# Altium schematic sheet Under Legs.SchDoc: =DocumentName
size A4; Organization: Queen's Formula SAE; Address1: 130 Stuart St, Kingston; Address2: Ontario; Address3: Canada; Address4: K7L 2V9; DocumentNumber: 1; Revision: 0; SheetNumber: 1; SheetTotal: 1
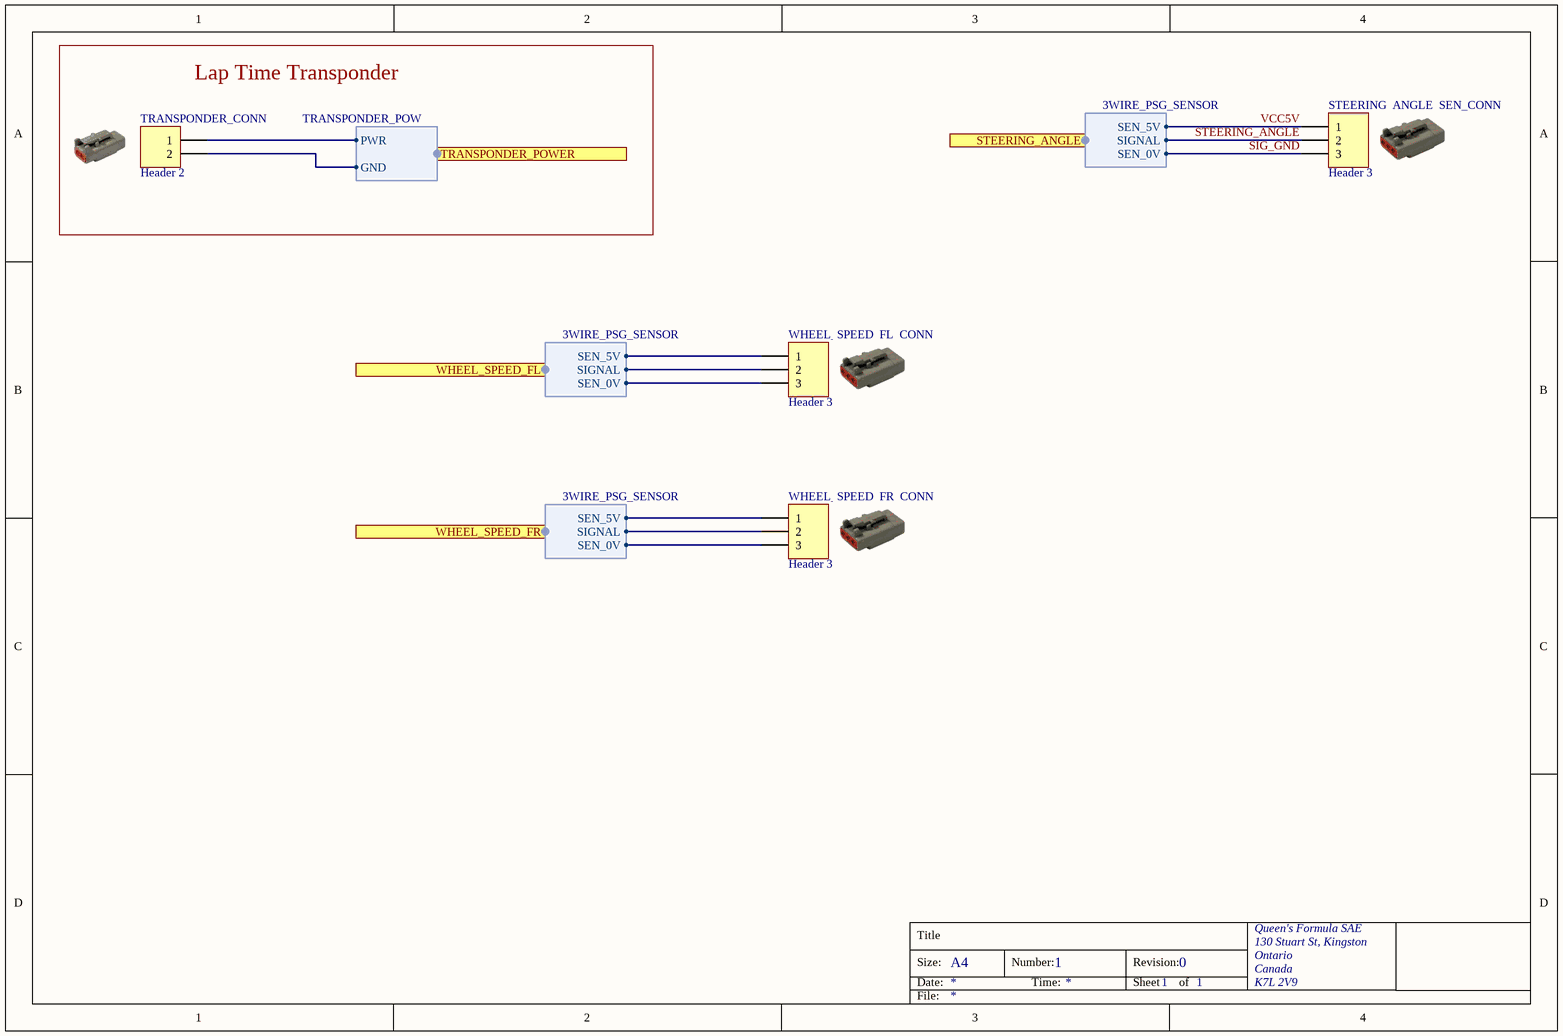
[diagram p0: Under Legs.SchDoc]

## Parts
STEERING_ANGLE_SEN_CONN  Header 3  [HDR1X3]
TRANSPONDER_CONN  Header 2  [HDR1X2]
WHEEL_SPEED_FL_CONN  Header 3  [HDR1X3]
WHEEL_SPEED_FR_CONN  Header 3  [HDR1X3]

## Blocks framed on the sheet
Lap Time Transponder: TRANSPONDER_CONN

## Ports
STEERING_ANGLE (harness 3WIRE_PSG_SENSOR), TRANSPONDER_POWER (harness TRANSPONDER_POW), WHEEL_SPEED_FL (harness 3WIRE_PSG_SENSOR), WHEEL_SPEED_FR (harness 3WIRE_PSG_SENSOR)

## Harnesses
3WIRE_PSG_SENSOR: SEN_5V, SEN_0V, SIGNAL
TRANSPONDER_POW: PWR, GND

## Nets
SIG_GND: STEERING_ANGLE_SEN_CONN.3 ; port STEERING_ANGLE.SEN_0V
STEERING_ANGLE: STEERING_ANGLE_SEN_CONN.2 ; port STEERING_ANGLE.SIGNAL
VCC5V: STEERING_ANGLE_SEN_CONN.1 ; port STEERING_ANGLE.SEN_5V
NetTRANSPONDER_CONN_1: TRANSPONDER_CONN.1 ; port TRANSPONDER_POWER.PWR
NetTRANSPONDER_CONN_2: TRANSPONDER_CONN.2 ; port TRANSPONDER_POWER.GND
NetWHEEL_SPEED_FL_CONN_1: WHEEL_SPEED_FL_CONN.1 ; port WHEEL_SPEED_FL.SEN_5V
NetWHEEL_SPEED_FL_CONN_2: WHEEL_SPEED_FL_CONN.2 ; port WHEEL_SPEED_FL.SIGNAL
NetWHEEL_SPEED_FL_CONN_3: WHEEL_SPEED_FL_CONN.3 ; port WHEEL_SPEED_FL.SEN_0V
NetWHEEL_SPEED_FR_CONN_1: WHEEL_SPEED_FR_CONN.1 ; port WHEEL_SPEED_FR.SEN_5V
NetWHEEL_SPEED_FR_CONN_2: WHEEL_SPEED_FR_CONN.2 ; port WHEEL_SPEED_FR.SIGNAL
NetWHEEL_SPEED_FR_CONN_3: WHEEL_SPEED_FR_CONN.3 ; port WHEEL_SPEED_FR.SEN_0V

## Notes on the sheet
- Title
- Size:
- Date:
- A4
- Number:
- Time:
- Revision:
- Sheet
- of
- File:

## Library data of the parts
STEERING_ANGLE_SEN_CONN WHEEL_SPEED_FL_CONN WHEEL_SPEED_FR_CONN = Header 3: Header, 3-Pin; LatestRevisionDate: 17-Jul-2002; LatestRevisionNote: Re-released for DXP Platform.; Publisher: Altium Limited
TRANSPONDER_CONN = Header 2: Header, 2-Pin; LatestRevisionDate: 17-Jul-2002; LatestRevisionNote: Re-released for DXP Platform.; Publisher: Altium Limited